# EAGLE schematic IV9 (EAGLE 9.5.2)
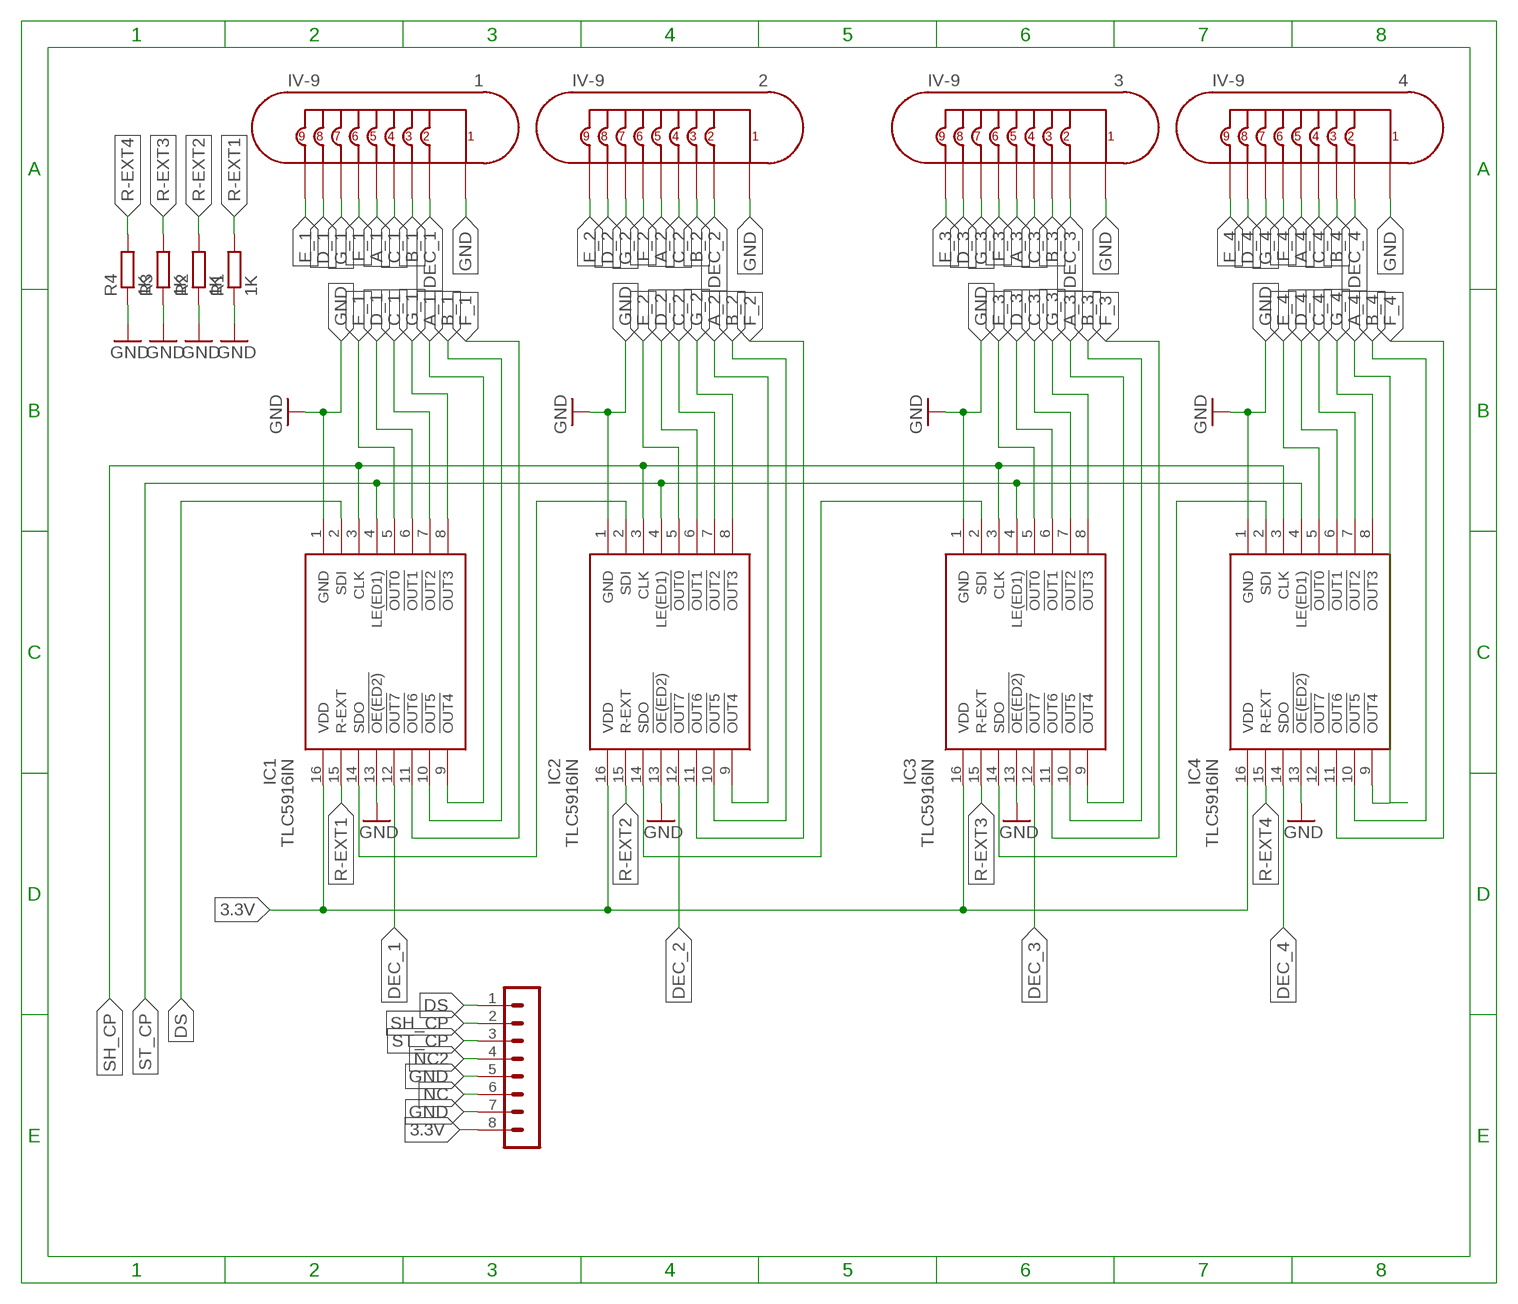
[diagram p0: schematic, sheet 1]

## Parts
1  IV-9  [IV-9]
2  IV-9  [IV-9]
3  IV-9  [IV-9]
4  IV-9  [IV-9]
IC1  TLC5916IN  [DIP794W53P254L1930H508Q16N]
IC2  TLC5916IN  [DIP794W53P254L1930H508Q16N]
IC3  TLC5916IN  [DIP794W53P254L1930H508Q16N]
IC4  TLC5916IN  [DIP794W53P254L1930H508Q16N]
R1  1K  R-EU_R1206  [R1206]
R2  1K  R-EU_R1206  [R1206]
R3  1K  R-EU_R1206  [R1206]
R4  1K  R-EU_R1206  [R1206]
SV2  PINHEADER-1X8  [MA08-1]

## Nets
3.3V: IC1.16(VDD) IC2.16(VDD) IC3.16(VDD) IC4.16(VDD) SV2.8
A_1: 1.5 IC1.9(!OUT4)
A_2: 2.5 IC2.9(!OUT4)
A_3: 3.5 IC3.9(!OUT4)
A_4: 4.5 IC4.9(!OUT4)
B_1: 1.3 IC1.10(!OUT5)
B_2: 2.3 IC2.10(!OUT5)
B_3: 3.3 IC3.10(!OUT5)
B_4: 4.3 IC4.10(!OUT5)
C_1: 1.4 IC1.7(!OUT2)
C_2: 2.4 IC2.7(!OUT2)
C_3: 3.4 IC3.7(!OUT2)
C_4: 4.4 IC4.7(!OUT2)
D_1: 1.8 IC1.6(!OUT1)
D_2: 2.8 IC2.6(!OUT1)
D_3: 3.8 IC3.6(!OUT1)
D_4: 4.8 IC4.6(!OUT1)
DEC_1: 1.2 IC1.12(!OUT7)
DEC_2: 2.2 IC2.12(!OUT7)
DEC_3: 3.2 IC3.12(!OUT7)
DEC_4: 4.2 IC4.14(SDO)
DS: IC1.2(SDI) SV2.1
E_1: 1.9 IC1.5(!OUT0)
E_2: 2.9 IC2.5(!OUT0)
E_3: 3.9 IC3.5(!OUT0)
E_4: 4.9 IC4.5(!OUT0)
F_1: 1.6 IC1.11(!OUT6)
F_2: 2.6 IC2.11(!OUT6)
F_3: 3.6 IC3.11(!OUT6)
F_4: 4.6 IC4.11(!OUT6)
G_1: 1.7 IC1.8(!OUT3)
G_2: 2.7 IC2.8(!OUT3)
G_3: 3.7 IC3.8(!OUT3)
G_4: 4.7 IC4.8(!OUT3)
GND: 1.1 2.1 3.1 4.1 IC1.1(GND) IC1.13(!OE(ED2)) IC2.1(GND) IC2.13(!OE(ED2)) IC3.1(GND) IC3.13(!OE(ED2)) IC4.1(GND) IC4.13(!OE(ED2)) R1.1 R2.1 R3.1 R4.1 SV2.5 SV2.7
N$49: IC1.14(SDO) IC2.2(SDI)
N$52: IC2.14(SDO) IC3.2(SDI)
N$53: IC3.14(SDO) IC4.2(SDI)
NC: SV2.6
NC2: SV2.4
R-EXT1: IC1.15(R-EXT) R1.2
R-EXT2: IC2.15(R-EXT) R2.2
R-EXT3: IC3.15(R-EXT) R3.2
R-EXT4: IC4.15(R-EXT) R4.2
SH_CP: IC1.3(CLK) IC2.3(CLK) IC3.3(CLK) IC4.3(CLK) SV2.2
ST_CP: IC1.4(LE(ED1)) IC2.4(LE(ED1)) IC3.4(LE(ED1)) IC4.4(LE(ED1)) SV2.3
Unconnected: IC4.12(!OUT7)

## Library data of the parts
1-4 = domestichacks:IV-9
IC1-IC4 = NixieTube:TLC5916IN: 8-CHANNEL CONSTANT-CURRENT LED SINK DRIVERS Source: Datasheet <http://www.ti.com/lit/gpn/tlc5916>; DESCRIPTION: 8-CHANNEL CONSTANT-CURRENT LED SINK DRIVERS; HEIGHT: 5.08mm; MANUFACTURER_NAME: Texas Instruments; MANUFACTURER_PART_NUMBER: TLC5916IN; MOUSER_PART_NUMBER: 595-TLC5916IN; MOUSER_PRICE-STOCK: https://www.mouser.com/Search/Refine.aspx?Keyword=595-TLC5916IN
R1-R4 = rcl:R-EU_: RESISTOR, European symbol; SPICEPREFIX: R
SV2 = CommonParts:PINHEADER-1X8: PIN HEADER; OC_FARNELL: unknown; OC_NEWARK: unknown

## Net classes
0 default: width 0.5 mm, drill 0.3 mm, clearance 0.2 mm
1 other: width 0.5 mm, drill 0.2 mm, clearance 0.2 mm